# EAGLE schematic teclado6teclas (EAGLE 6.1)
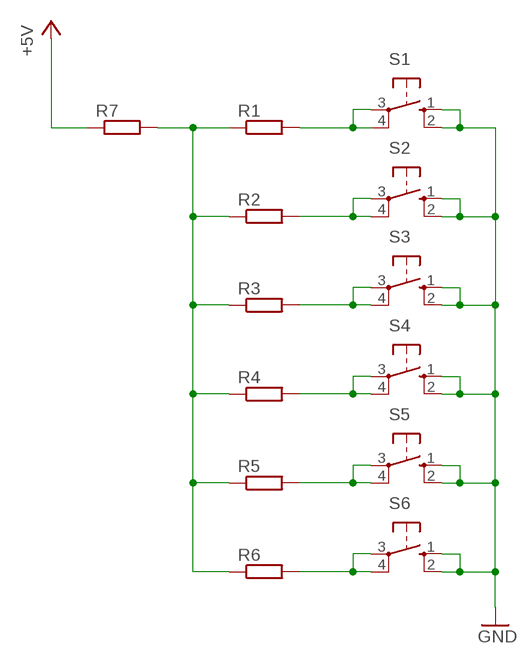
[diagram p0: schematic, sheet 1]

## Parts
R1  R-EU_0204/7  [0204/7]
R2  R-EU_0204/7  [0204/7]
R3  R-EU_0204/7  [0204/7]
R4  R-EU_0204/7  [0204/7]
R5  R-EU_0204/7  [0204/7]
R6  R-EU_0204/7  [0204/7]
R7  R-EU_0204/7  [0204/7]
S1  10-XX  [B3F-10XX]
S2  10-XX  [B3F-10XX]
S3  10-XX  [B3F-10XX]
S4  10-XX  [B3F-10XX]
S5  10-XX  [B3F-10XX]
S6  10-XX  [B3F-10XX]

## Nets
+5V: R7.1
GND: S6.1(S) S6.2(S1)
N$1: R1.1 R2.1 R3.1 R4.1 R5.1 R6.1 R7.2
N$2: R2.2 S2.3(P) S2.4(P1)
N$3: R3.2 S3.3(P) S3.4(P1)
N$4: R4.2 S4.3(P) S4.4(P1)
N$5: R5.2 S5.3(P) S5.4(P1)
N$6: R6.2 S6.3(P) S6.4(P1)
N$7: S1.1(S) S1.2(S1) S2.1(S) S2.2(S1) S3.1(S) S3.2(S1) S4.1(S) S4.2(S1) S5.1(S) S5.2(S1)
N$8: R1.2 S1.3(P) S1.4(P1)

## Library data of the parts
R1-R7 = resistor:R-EU_: RESISTOR, European symbol
S1-S6 = switch-omron:10-XX: OMRON SWITCH; MPN: B3F-1000; OC_FARNELL: 176432; OC_NEWARK: 36M3542